# EAGLE design TinyEncoderReader (EAGLE 7.5.0)
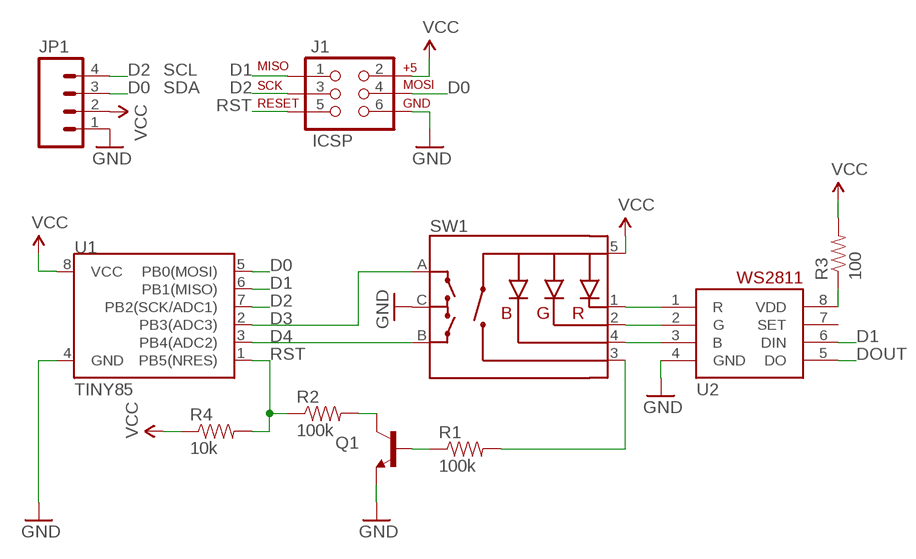
[diagram p0: schematic, sheet 1]

## Parts
J1  ICSP  AVR_SPI_PRG_6LABELED  [2X3-NS]
JP1  M04PTH  [1X04]
Q1  TRANSISTOR_NPNTO-92-AMMO  [TO-92-AMMO]
R1  100k  RESISTORAXIAL-0.3  [AXIAL-0.3]
R2  100k  RESISTORAXIAL-0.3  [AXIAL-0.3]
R3  100  RESISTORAXIAL-0.3  [AXIAL-0.3]
R4  10k  RESISTORAXIAL-0.3  [AXIAL-0.3]
SW1  ENCODER_RGB_CA  [ENCODER_LED_3]
U1  TINY85  ATTINY45TINY85-20-DIP  [DIP08]
U2  WS2811  WS2811-SOP8  [SO08-SKINNYPADS]

## Nets
BLUE: SW1.4(-B) U2.3(B)
D0: J1.4(MOSI) JP1.3 U1.5(PB0(MOSI))
D1: J1.1(MISO) U1.6(PB1(MISO)) U2.6(DIN)
D2: J1.3(SCK) JP1.4 U1.7(PB2(SCK/ADC1))
D3: SW1.A U1.2(PB3(ADC3))
D4: SW1.B U1.3(PB4(ADC2))
DOUT: U2.5(DO)
GND: J1.6(GND) JP1.1 Q1.1(E) SW1.C U1.4(GND) U2.4(GND)
GREEN: SW1.2(-G) U2.2(G)
N$6: R1.P$2 SW1.3(SW)
N$7: Q1.2(B) R1.P$1
N$8: Q1.3(C) R2.P$2
RED: SW1.1(-R) U2.1(R)
RST: J1.5(RST) R2.P$1 R4.P$2 U1.1(PB5(NRES))
VCC: J1.2(V+) JP1.2 R3.P$2 R4.P$1 SW1.5(+) U1.8(VCC)
VDD: R3.P$1 U2.8(VDD)
Unconnected: U2.7(SET)

## Notes on the sheet
- SCL
- SDA

## Library data of the parts
J1 = barbary_enterprises:AVR_SPI_PRG_6: AVR ISP 6 Pin This is the reduced ISP connector for AVR programming. Common on Arduino. This footprint will take up less PCB space and can be used with a 10-pin to 6-pin adapter such as SKU: BOB-08508
JP1 = SparkFun-Connectors:M04: Header 4 Standard 4-pin 0.1" header. Use with straight break away headers (SKU : PRT-00116), right angle break away headers (PRT-00553), swiss pins (PRT-00743), machine pins (PRT-00117), and female headers (PRT-00115). Molex polarized connector foot print use with SKU : PRT-08231 with associated crimp pins and housings. 1MM SMD Version SKU: PRT-10208
Q1 = barbary_enterprises:TRANSISTOR_NPN: Generic NPN BJT MMBT2222A - TRANS-08049 (SOT-23, 1A 40V) MPSA42 - TRANS-09116 (SOT-23, 500mA 300V) MMBT5088LT1G - TRANS-11160 (SOT-23, 50 mA 30V)
R1-R4 = barbary_enterprises:RESISTOR: Resistor Basic schematic elements and footprints for 0603, 1206, and PTH resistors.
SW1 = SparkFun-Electromechanical:ENCODER_RGB_CA: Illuminated Rotary Encoder w/ RGB LED and select switch EC12PLRGBSDVBF-D: http://top-up.so-buy.com/front/bin/ptdetail.phtml?Part=EC12PLRGBSDVBF-D
U1 = SparkFun-DigitalIC:ATTINY45: Atmel 8-pin 2/4/8kB flash uC; PROD_ID: IC-09445; VALUE: TINY85-20-DIP
U2 = adafruit:WS2811

## Board
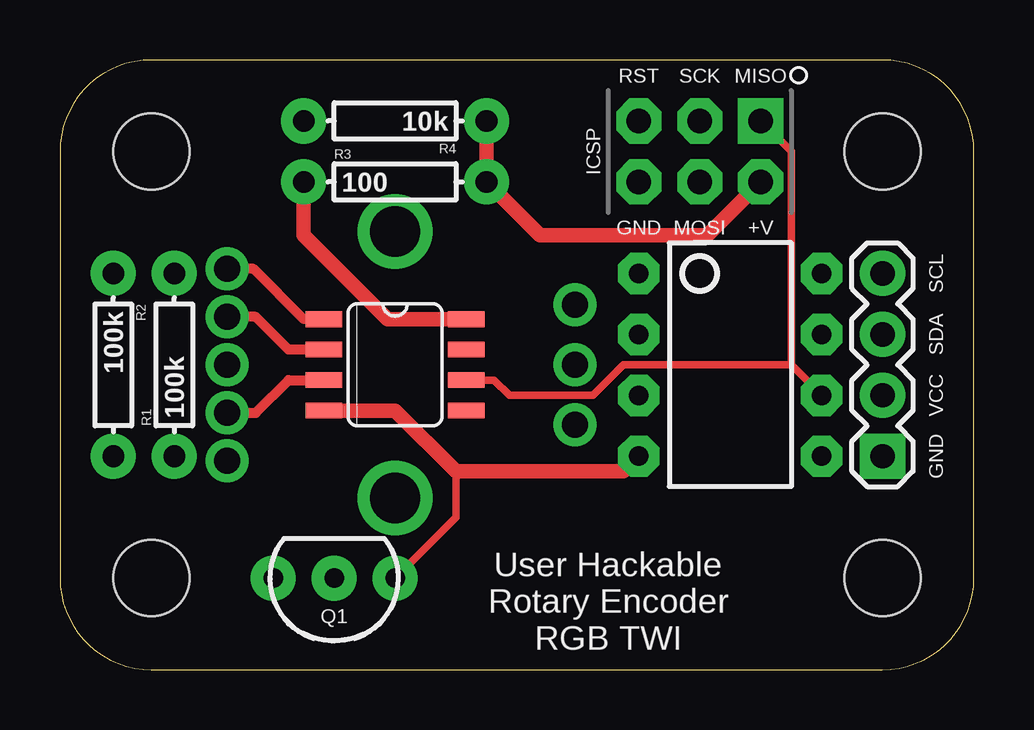
[diagram p1: board, top side]
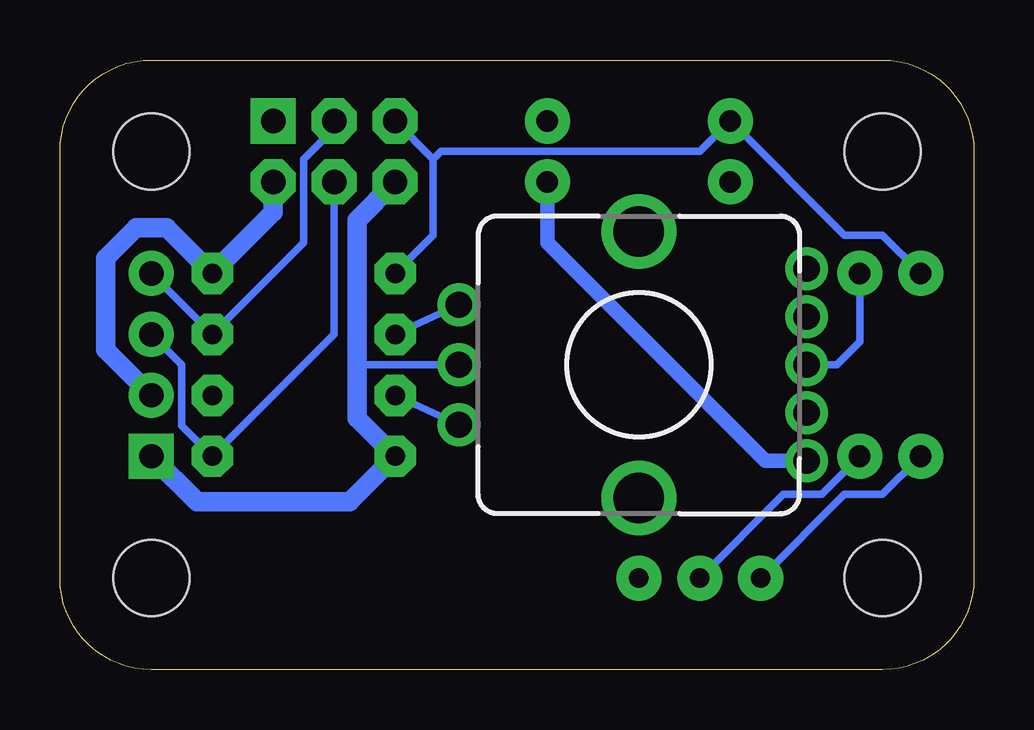
[diagram p2: board, bottom side, seen from below]

Size 38.1 x 25.4 mm. Coordinates in mm from the lower left corner, seen from the top.
Outline: 0,21.59 0,3.81 arc90 3.81,0 34.29,0 arc90 38.1,3.81 38.1,21.59 arc90 34.29,25.4 3.81,25.4 arc90 0,21.59
Copper layers (1*16): Top 0.035mm / dielectric 1.5mm / Bottom 0.035mm
Design rules "default": minimum track width 10mil, minimum drill 24mil, track to track 8mil, track to pad 8mil, pad to pad 8mil, via to via 8mil, smd to smd 8mil, copper to edge 40mil, drill to drill 8mil, minimum pad ring 10mil, minimum via ring 8mil, stop-mask expansion 4mil, vias tented up to drill 0mil, thermal gap 10mil
Holes 3.17 mm at 3.81,3.81 34.29,3.81 34.29,21.59 3.81,21.59

### Footprints (pad centres in the part's own frame; a part is rotated, then mirrored left to right if it is on the bottom)
2X3-NS = drill 1.016 pad 1.88 square: 1 -2.54,-1.27 | drill 1.016 pad 1.88 octagon: 2 -2.54,1.27; 3 0,-1.27; 4 0,1.27; 5 2.54,-1.27; 6 2.54,1.27
1X04 = drill 1.016 pad 1.88 square: 1 0,0 | drill 1.016 pad 1.88: 2 2.54,0; 3 5.08,0; 4 7.62,0
TO-92-AMMO = drill 0.813 pad 1.88: 1 -2.54,0; 2 0,0; 3 2.54,0
AXIAL-0.3 = drill 0.9 pad 1.88: P$1 -3.81,0; P$2 3.81,0
ENCODER_LED_3 = drill 1.1 pad 1.778: 1 -4,7; 2 -2,7; 3 0,7; 4 2,7; 5 4,7 | drill 1.1 pad 1.8: A -2.5,-7.5; B 2.5,-7.5; C 0,-7.5 | drill 2.1: M1 -5.55,0; M2 5.55,0
DIP08 = drill 0.813 pad 1.727 octagon: 1 -3.81,-3.81; 2 -1.27,-3.81; 3 1.27,-3.81; 4 3.81,-3.81; 5 3.81,3.81; 6 1.27,3.81; 7 -1.27,3.81; 8 -3.81,3.81
SO08-SKINNYPADS = smd 0.66 x 1.524: 1 -1.905,-2.973; 2 -0.635,-2.973; 3 0.635,-2.973; 4 1.905,-2.973; 5 1.905,2.973; 6 0.635,2.973; 7 -0.635,2.973; 8 -1.905,2.973

### Placement (x,y rotation side)
J1  26.67,21.59 180 top
JP1  34.29,8.89 90 top
Q1  11.43,3.81 180 top
R1  4.76,12.7 90 top
R2  2.22,12.7 270 top
R3  13.97,20.32 0 top
R4  13.97,22.86 180 top
SW1  13.97,12.7 270 bottom
U1  27.94,12.7 270 top
U2  13.97,12.7 270 top

### Tracks (layer width: path | path; a pad name or v marks a point on that pad's centre or on a via)
BLUE
  Top 0.406: SW1.4 8.16,10.7 9.53,12.06 U2.3
D0
  Bottom 0.305: JP1.3 33.02,12.7 33.02,10.16 U1.5 26.67,13.97 J1.4
D1
  Top 0.305: J1.1 30.48,21.59 30.48,12.7 | 30.48,12.7 U1.6 | U2.6 18.1,12.06 18.73,11.43 22.23,11.43 23.5,12.7 30.48,12.7
D2
  Bottom 0.305: JP1.4 U1.7 27.94,17.78 27.94,21.27 26.67,22.54 J1.3
D3
  Bottom 0.305: SW1.A U1.2
D4
  Bottom 0.305: SW1.B U1.3
GND
  Top 0.305: Q1.1 16.51,6.35 16.51,8.26
  Top 0.61: U2.4 13.97,10.79 16.51,8.26 23.5,8.26 U1.4
  Bottom 0.305: SW1.C 25.72,12.7
  Bottom 0.813: JP1.1 32.38,6.99 26.04,6.99 U1.4 25.72,10.48 25.72,12.7 25.72,18.73 J1.6
GREEN
  Top 0.406: U2.2 9.53,13.34 8.16,14.7 SW1.2
N$6
  Bottom 0.305: SW1.3 5.71,12.7 4.76,13.65 R1.P$2
N$7
  Bottom 0.305: R1.P$1 6.35,7.3 7.94,7.3 Q1.2
N$8
  Bottom 0.305: Q1.3 5.4,7.3 3.81,7.3 R2.P$2
RED
  Top 0.406: U2.1 10.16,14.61 8.06,16.7 SW1.1
RST
  Bottom 0.305: J1.5 22.54,21.27 | 22.54,21.27 22.54,18.1 U1.1 | 22.54,21.27 22.23,21.59 11.43,21.59 R4.P$2 5.4,18.1 3.81,18.1 R2.P$1
VCC
  Top 0.61: J1.2 26.99,18.1 20,18.1 R3.P$2 R4.P$1
  Bottom 0.61: SW1.5 8.7,8.7 17.78,17.78 R3.P$2
  Bottom 0.813: JP1.2 36.2,13.34 36.2,17.14 34.92,18.41 33.66,18.41 U1.8 29.21,19.05 J1.2
VDD
  Top 0.61: R3.P$1 10.16,18.1 13.65,14.61 U2.8

### Text on the board
tPlace: ICSP | SCL | SDA | VCC | GND | User Hackable / Rotary Encoder / RGB TWI